# EAGLE design Grove - Relay v1.2 (EAGLE 7.2.0)
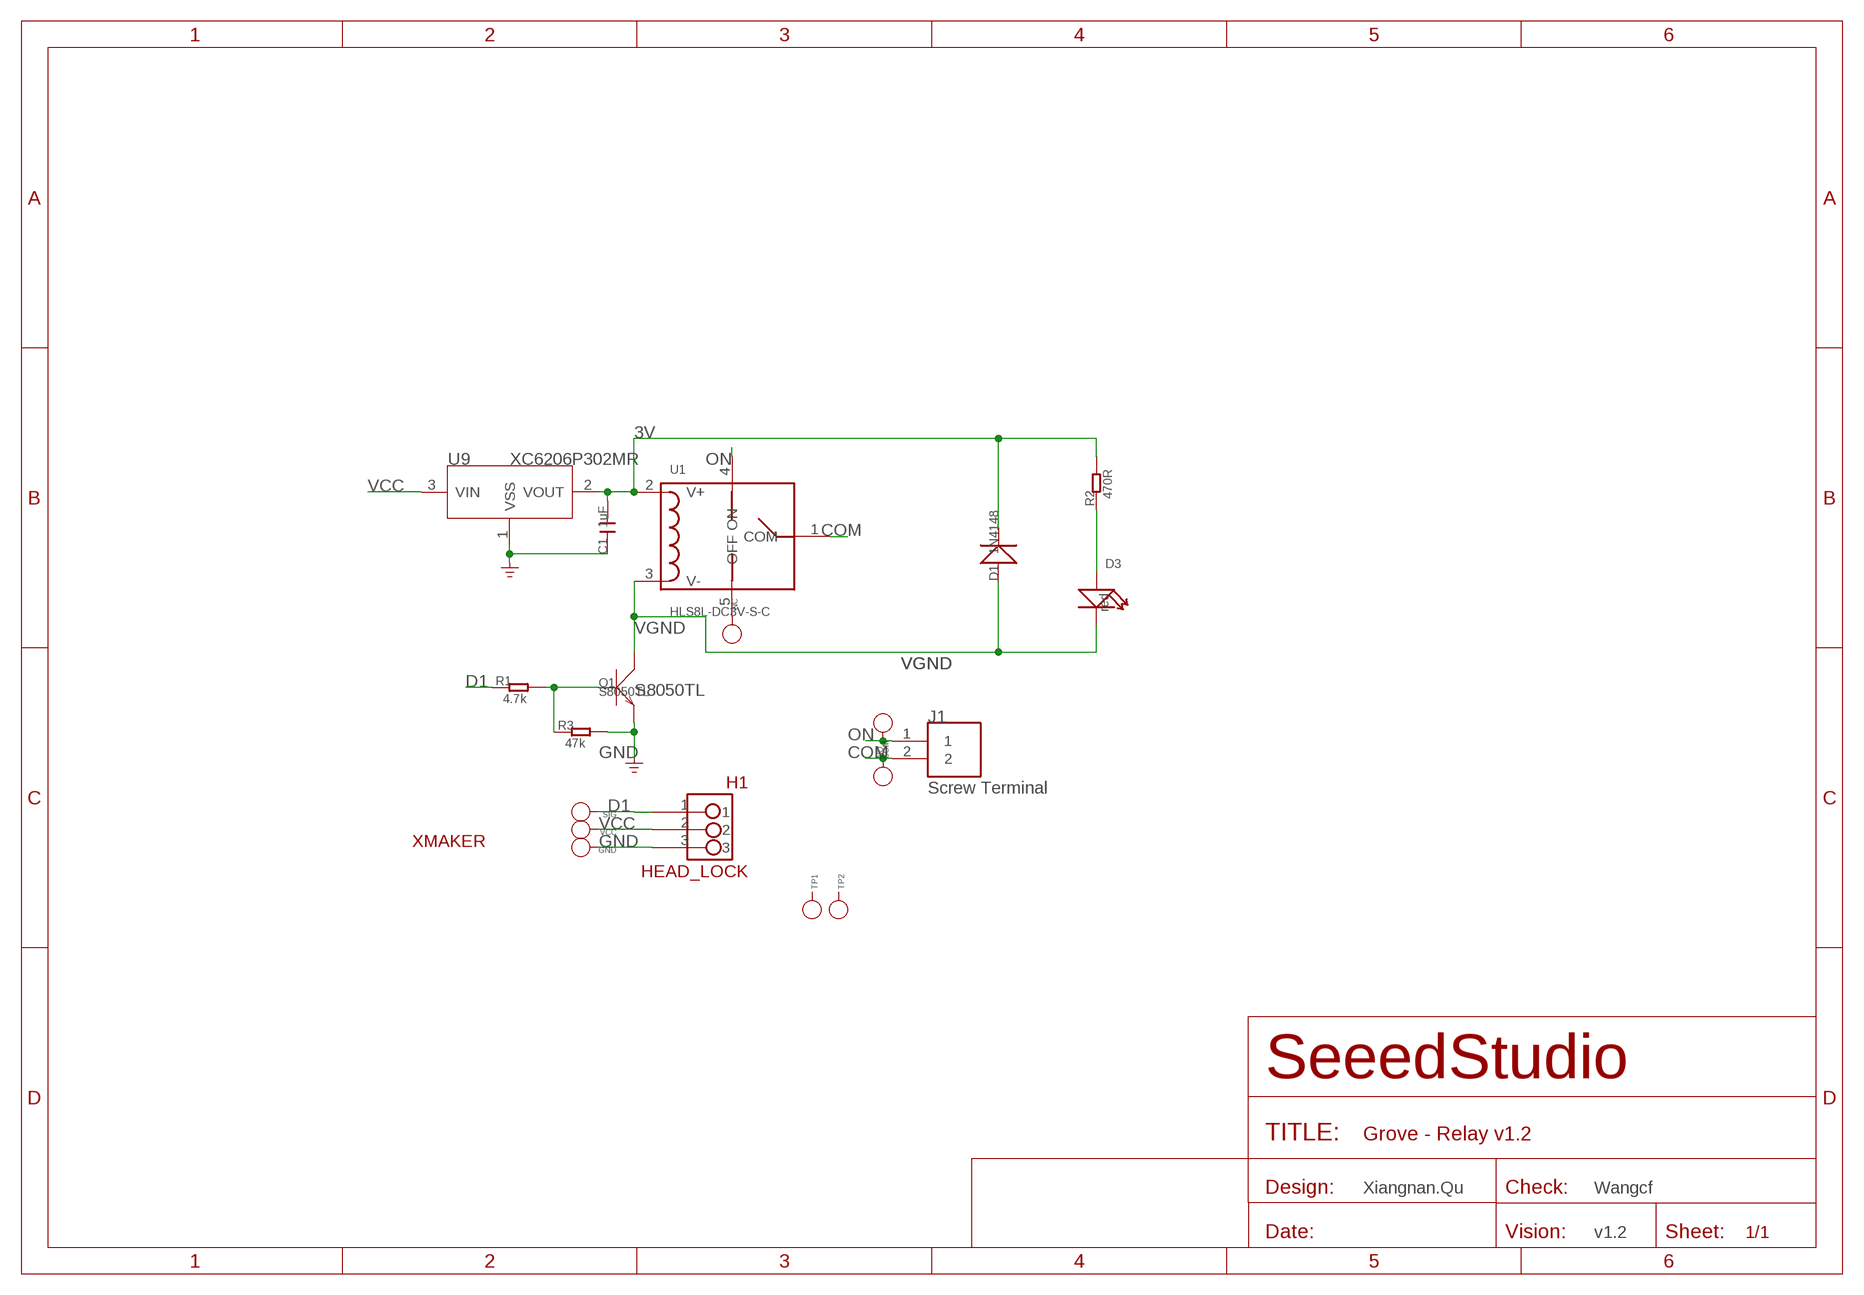
[diagram p0: schematic, sheet 1]

## Parts
C1  1uF  C-0603  [C0603]
COM  PAD-TEST-POINT'4545'  [TP_4545]
D1  1N4148  D'1N4148-SMD'  [LL-34]
D3  red  LED'0603'  [LED-0603]
GND  PAD-TEST-POINT'4545'  [TP_4545]
H1  HEAD_LOCK  [HEAD_LOCK]
J1  Screw Terminal  CON2  [CON2]
NC  PAD-TEST-POINT'4545'  [TP_4545]
NO  PAD-TEST-POINT'4545'  [TP_4545]
Q1  S8050TL  TRANSISTOR-NPN-SOT23  [SOT23]
R1  4.7k  R-0603  [R0603]
R2  470R  R-0603  [R0603]
R3  47k  R-0603  [R0603]
SIG  PAD-TEST-POINT'4545'  [TP_4545]
TP1  PAD-TEST-POINT'4545'  [TP_4545]
TP2  PAD-TEST-POINT'4545'  [TP_4545]
U1  HLS8L-DC3V-S-C  RELAY  [RELAY]
U9  XC6206P302MR  XC6206MR  [SOT23]
U$5  XMAKERLOGO2  [XMAKERLOGO2]
VCC  PAD-TEST-POINT'4545'  [TP_4545]

## Nets
3V: C1.2 D1.C(-) R2.2 U1.2(V+) U9.2(VOUT)
COM: COM.T J1.2 U1.1(COM)
D1: H1.1 R1.1 SIG.T
GND: C1.1 GND.T H1.3 Q1.2(E) R3.2 U9.1(VSS)
N$1: D3.+ R2.1
N$2: Q1.1(B) R1.2 R3.1
N$3: NC.T U1.5(OFF)
ON: J1.1 NO.T U1.4(ON)
VCC: H1.2 U9.3(VIN) VCC.T
VGND: D1.A(+) D3.- Q1.3(C) U1.3(V-)
Unconnected: TP1.T TP2.T

## Notes on the sheet
- S8050TL
- Xiangnan.Qu | Wangcf
- v1.2

## Library data of the parts
C1 = Discrete:C*: Ceramic Capacitors
COM GND NC NO SIG TP1 TP2 VCC = Discrete:PAD-TEST-POINT; PARTNO: DNP
D1 = Discrete:D*
D3 = Discrete:LED*
H1 = HEAD_LOCK:HEAD_LOCK: 带锁的排座
J1 = seeedleo:CON2
Q1 = Discrete:TRANSISTOR-NPN*: NPN audion
R1-R3 = Discrete:R*
U1 = Seeed:RELAY
U9 = IC:XC6206: LOW ESR Cap.Compatible Positive Voltage Regulators
U$5 = Xmaker_yuhui:XMAKERLOGO2

## Board
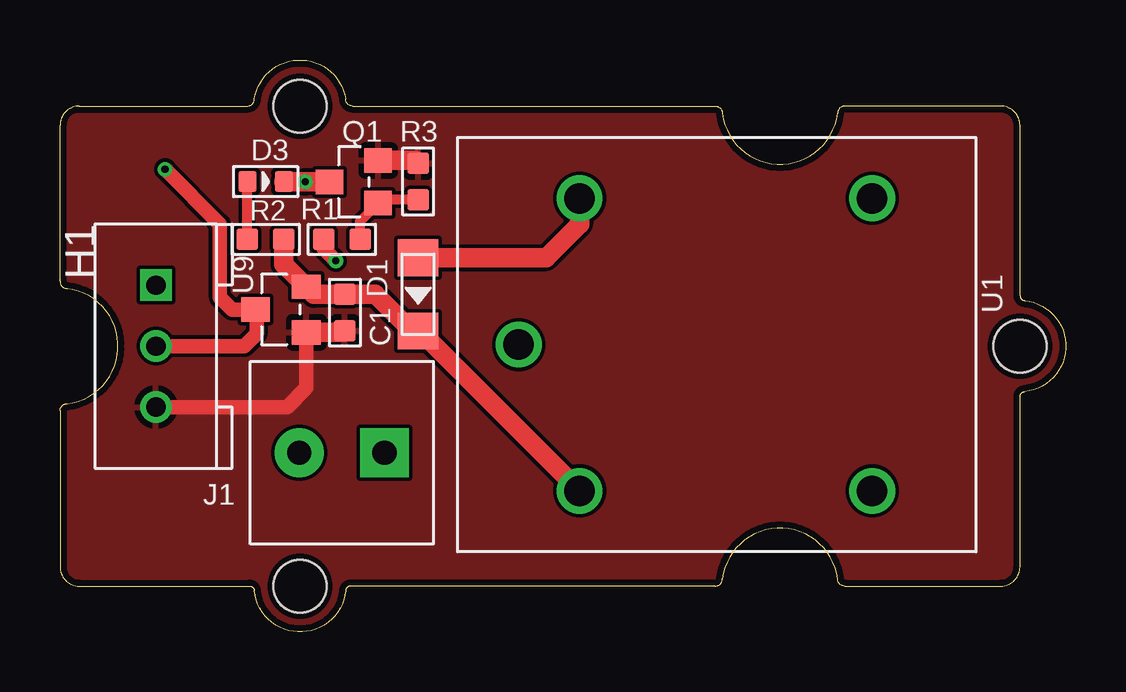
[diagram p1: board, top side]
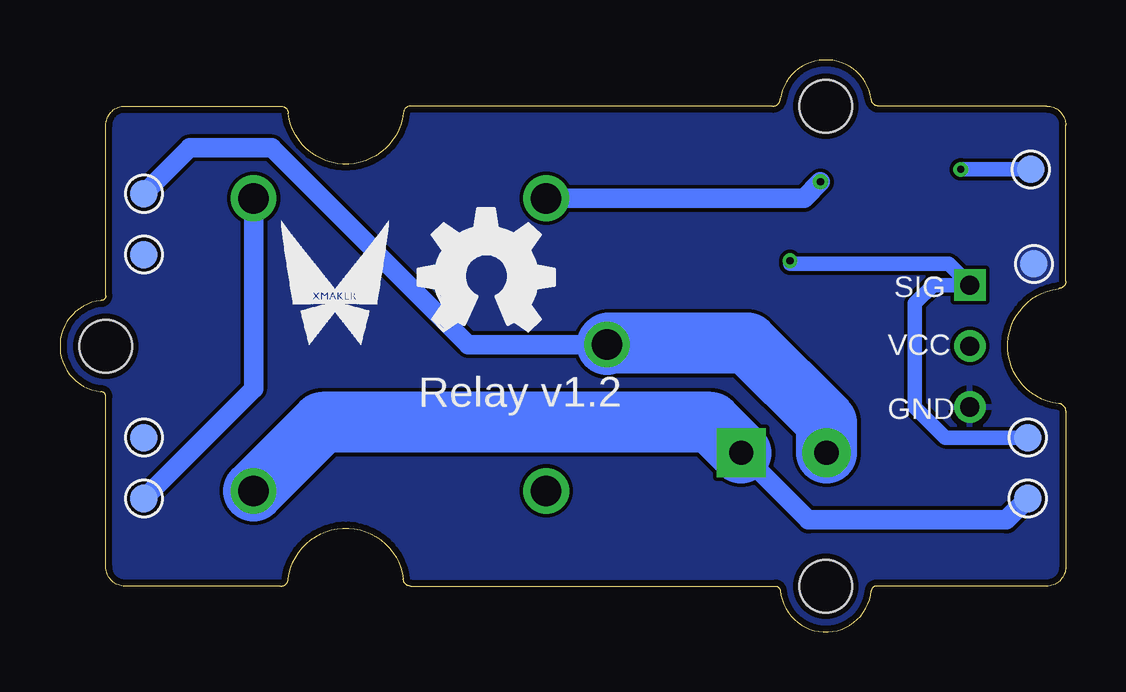
[diagram p2: board, bottom side, seen from below]

Size 41.91 x 23.83 mm. Coordinates in mm from the lower left corner, seen from the top.
Copper layers (1*16): Top 0.035mm / dielectric 1.5mm / Bottom 0.035mm
Design rules "default": minimum track width 6mil, minimum drill 12mil, track to track 6mil, track to pad 6mil, pad to pad 6mil, via to via 6mil, smd to smd 0mil, copper to edge 10mil, drill to drill 10mil, minimum pad ring 10mil, minimum via ring 6mil, stop-mask expansion 2mil, vias tented up to drill 100mil, thermal gap 10mil

### Footprints (pad centres in the part's own frame; a part is rotated, then mirrored left to right if it is on the bottom)
C0603 = smd 0.889 x 0.889: 1 -0.762,0; 2 0.762,0
TP_4545 = smd 1.143 x 1.143: T 0,0
LL-34 = smd 1.524 x 1.676: A -1.524,0; C 1.524,0
LED-0603 = smd 0.762 x 0.889: + -0.762,0; - 0.762,0
HEAD_LOCK = drill 0.8 square: 1 0,0 | drill 0.8: 2 2.54,0; 3 5.08,0
CON2 = drill 1.016 pad 2.032 square: 1 0,1.778 | drill 1.016 pad 2.032: 2 0,-1.778
SOT23 = smd 1.016 x 1.143: 1 -0.889,-1.016; 2 0.889,-1.016; 3 0,1.016
R0603 = smd 0.889 x 0.889: 1 -0.762,0; 2 0.762,0
RELAY = drill 1.27: 1 -2.54,-6.096; 2 0,-12.192; 3 0,0; 4 12.192,-12.192; 5 12.192,0
SOT23' = smd 1.016 x 1.2: 1 -0.95,-1.06; 2 0.95,-1.06; 3 0,1.06
GROVE-TEST-PLATFORM = hole 2.2: -10,-10; -10,10; 20,0

### Placement (x,y rotation side)
C1  11.87,13.31 90 top
COM  38.41,18.26 0 bottom
D1  14.92,14.07 270 top
D3  8.57,18.77 0 top
GND  1.33,15.34 0 bottom
H1  4,14.45 270 top
J1  11.74,7.46 270 top
NC  38.41,5.56 0 bottom
NO  1.59,5.56 0 bottom
Q1  12.24,18.75 90 top
R1  11.74,16.35 0 top
R2  8.57,16.35 0 top
R3  14.92,18.77 90 top
SIG  1.59,8.1 0 bottom
TP1  38.41,15.72 0 bottom
TP2  38.41,8.1 0 bottom
U1  21.65,18.07 0 top
U9  XC6206P302MR  [SOT23']  9.21,13.43 90 top
U$2  [OSHW_FILLX200_NOTEXT]  26.98,12.54 0 bottom
U$3  [GROVE-TEST-PLATFORM]  20,11.91 0 top
U$5  33.97,11.02 0 bottom
VCC  1.46,19.27 0 bottom

### Tracks (layer width: path | path; a pad name or v marks a point on that pad's centre or on a via)
3V
  Top 0.813: U1.2 14.98,12.54 D1.C 14.67,12.54 13.14,14.07 C1.2 10.58,14.07 U9.2 9.33,15.32 R2.2
COM
  Bottom 0.813: U1.1 24.89,11.97 33.08,20.16 36.51,20.16 COM.T
  Bottom 2.54: J1.2 9.97,8.73 13.27,12.04 19.05,12.04 U1.1
D1  (via drill 0.3)
  Top 0.61: R1.1 10.98,15.97 v11.49,15.46
  Bottom 0.61: v11.49,15.46 11.49,15.34 4.89,15.34 H1.1 5.52,14.45 6.28,13.69 6.28,9.37 5.01,8.1 SIG.T
GND
  Top 0.61: U9.1 10.27,10.17 9.46,9.37 H1.3
  Top 0.813: Q1.2 14.81,19.64 R3.2 | U9.1 11.81,12.48 C1.1
  pour Bottom: -0.95,26.01 42.48,26.01 42.48,-2.06 -0.95,-2.06
  pour Top: -0.95,26.01 42.48,26.01 42.48,-2.06 -0.95,-2.06
N$1
  Top 0.406: R2.1 D3.+
N$2
  Top 0.406: R1.2 12.51,17.12 Q1.1 13.4,18 R3.1
N$3
  Bottom 0.813: NC.T 33.84,10.13 U1.5
ON
  Bottom 0.813: NO.T 2.47,4.67 10.73,4.67 J1.1
  Bottom 2.54: U1.4 30.99,8.73 14.79,8.73 J1.1
VCC  (via drill 0.3)
  Top 0.61: H1.2 7.68,11.91 8.19,12.42 8.19,13.43 U9.3 7.17,13.43 6.66,13.94 6.66,16.99 v4.38,19.27
  Bottom 0.61: v4.38,19.27 VCC.T
VGND  (via drill 0.3 pad 0.64)
  Top 0.813: D1.A 20.25,15.59 21.65,16.99 U1.3 | D3.- 10.21,18.77 v10.22,18.75 Q1.3
  Bottom 0.813: U1.3 10.91,18.07 v10.22,18.75

### Text on the board
bPlace: SIG | VCC | GND | Relay v1.2